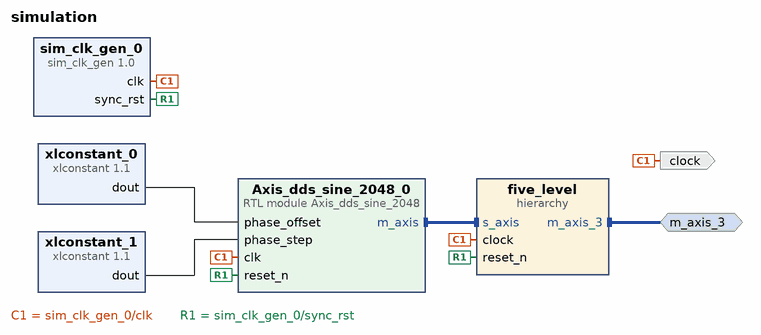
[diagram p0: block diagram of the top level]
# Vivado block design simulation, xc7z020clg400-1, Vivado 2025.2
create_bd_design simulation

create_bd_intf_port -mode Master -vlnv xilinx.com:interface:axis_rtl:1.0 m_axis_3
create_bd_port -dir O clock

create_bd_cell -type ip -vlnv xilinx.com:ip:sim_clk_gen:1.0 sim_clk_gen_0
create_bd_cell -type module -reference Axis_dds_sine_2048 Axis_dds_sine_2048_0
create_bd_cell -type ip -vlnv xilinx.com:ip:xlconstant:1.1 xlconstant_0
create_bd_cell -type ip -vlnv xilinx.com:ip:xlconstant:1.1 xlconstant_1
set_property -dict {CONFIG.CONST_VAL 33333333 CONFIG.CONST_WIDTH 32} [get_bd_cells xlconstant_1]
create_bd_cell -type hier five_level

# ---- hierarchy /five_level ----
current_bd_instance /five_level
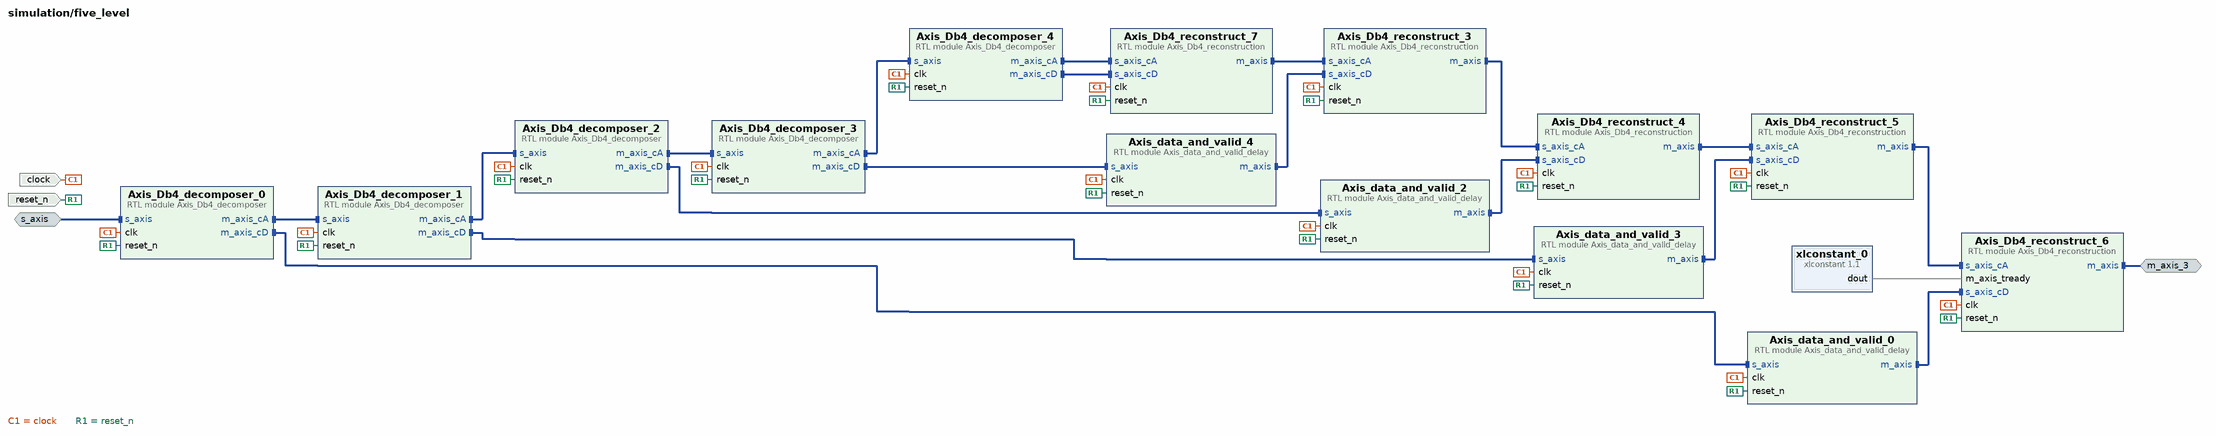
[diagram p1: block diagram inside /five_level]
create_bd_intf_pin -mode Slave -vlnv xilinx.com:interface:axis_rtl:1.0 s_axis
create_bd_intf_pin -mode Master -vlnv xilinx.com:interface:axis_rtl:1.0 m_axis_3
create_bd_pin -dir I -type clk clock
create_bd_pin -dir I -type rst reset_n

create_bd_cell -type module -reference Axis_Db4_decomposer Axis_Db4_decomposer_0
create_bd_cell -type module -reference Axis_data_and_valid_delay Axis_data_and_valid_0
set_property -dict {CONFIG.DATA_WIDTH 32 CONFIG.DELAY 292} [get_bd_cells Axis_data_and_valid_0]
create_bd_cell -type module -reference Axis_Db4_decomposer Axis_Db4_decomposer_1
create_bd_cell -type module -reference Axis_Db4_decomposer Axis_Db4_decomposer_2
create_bd_cell -type module -reference Axis_Db4_decomposer Axis_Db4_decomposer_3
create_bd_cell -type module -reference Axis_Db4_reconstruction Axis_Db4_reconstruct_3
set_property -dict {CONFIG.LEVEL 4} [get_bd_cells Axis_Db4_reconstruct_3]
create_bd_cell -type module -reference Axis_data_and_valid_delay Axis_data_and_valid_2
set_property -dict {CONFIG.DATA_WIDTH 32 CONFIG.DELAY 218} [get_bd_cells Axis_data_and_valid_2]
create_bd_cell -type module -reference Axis_Db4_reconstruction Axis_Db4_reconstruct_4
set_property -dict {CONFIG.LEVEL 3} [get_bd_cells Axis_Db4_reconstruct_4]
create_bd_cell -type module -reference Axis_data_and_valid_delay Axis_data_and_valid_3
set_property -dict {CONFIG.DATA_WIDTH 32 CONFIG.DELAY 263} [get_bd_cells Axis_data_and_valid_3]
create_bd_cell -type module -reference Axis_Db4_reconstruction Axis_Db4_reconstruct_5
set_property -dict {CONFIG.LEVEL 2} [get_bd_cells Axis_Db4_reconstruct_5]
create_bd_cell -type module -reference Axis_Db4_reconstruction Axis_Db4_reconstruct_6
set_property -dict {CONFIG.LEVEL 1} [get_bd_cells Axis_Db4_reconstruct_6]
create_bd_cell -type module -reference Axis_Db4_decomposer Axis_Db4_decomposer_4
create_bd_cell -type module -reference Axis_Db4_reconstruction Axis_Db4_reconstruct_7
set_property -dict {CONFIG.LEVEL 5} [get_bd_cells Axis_Db4_reconstruct_7]
create_bd_cell -type ip -vlnv xilinx.com:ip:xlconstant:1.1 xlconstant_0
create_bd_cell -type module -reference Axis_data_and_valid_delay Axis_data_and_valid_4
set_property -dict {CONFIG.DATA_WIDTH 32 CONFIG.DELAY 141} [get_bd_cells Axis_data_and_valid_4]

# ---- connections ----

current_bd_instance /five_level
connect_bd_intf_net [get_bd_intf_pins Axis_Db4_decomposer_0/m_axis_cA] [get_bd_intf_pins Axis_Db4_decomposer_1/s_axis]
connect_bd_intf_net [get_bd_intf_pins Axis_Db4_decomposer_0/m_axis_cD] [get_bd_intf_pins Axis_data_and_valid_0/s_axis]
connect_bd_intf_net [get_bd_intf_pins Axis_Db4_decomposer_1/m_axis_cA] [get_bd_intf_pins Axis_Db4_decomposer_2/s_axis]
connect_bd_intf_net [get_bd_intf_pins Axis_Db4_decomposer_1/m_axis_cD] [get_bd_intf_pins Axis_data_and_valid_3/s_axis]
connect_bd_intf_net [get_bd_intf_pins Axis_Db4_decomposer_2/m_axis_cA] [get_bd_intf_pins Axis_Db4_decomposer_3/s_axis]
connect_bd_intf_net [get_bd_intf_pins Axis_Db4_decomposer_2/m_axis_cD] [get_bd_intf_pins Axis_data_and_valid_2/s_axis]
connect_bd_intf_net [get_bd_intf_pins Axis_Db4_decomposer_3/m_axis_cA] [get_bd_intf_pins Axis_Db4_decomposer_4/s_axis]
connect_bd_intf_net [get_bd_intf_pins Axis_Db4_decomposer_3/m_axis_cD] [get_bd_intf_pins Axis_data_and_valid_4/s_axis]
connect_bd_intf_net [get_bd_intf_pins Axis_Db4_decomposer_4/m_axis_cA] [get_bd_intf_pins Axis_Db4_reconstruct_7/s_axis_cA]
connect_bd_intf_net [get_bd_intf_pins Axis_Db4_decomposer_4/m_axis_cD] [get_bd_intf_pins Axis_Db4_reconstruct_7/s_axis_cD]
connect_bd_intf_net [get_bd_intf_pins Axis_Db4_reconstruct_3/m_axis] [get_bd_intf_pins Axis_Db4_reconstruct_4/s_axis_cA]
connect_bd_intf_net [get_bd_intf_pins Axis_Db4_reconstruct_4/m_axis] [get_bd_intf_pins Axis_Db4_reconstruct_5/s_axis_cA]
connect_bd_intf_net [get_bd_intf_pins Axis_Db4_reconstruct_5/m_axis] [get_bd_intf_pins Axis_Db4_reconstruct_6/s_axis_cA]
connect_bd_intf_net [get_bd_intf_pins Axis_Db4_reconstruct_7/m_axis] [get_bd_intf_pins Axis_Db4_reconstruct_3/s_axis_cA]
connect_bd_intf_net -intf_net Axis_adder_0_m_axis [get_bd_intf_pins s_axis] [get_bd_intf_pins Axis_Db4_decomposer_0/s_axis]
connect_bd_intf_net [get_bd_intf_pins Axis_data_and_valid_0/m_axis] [get_bd_intf_pins Axis_Db4_reconstruct_6/s_axis_cD]
connect_bd_intf_net [get_bd_intf_pins Axis_data_and_valid_2/m_axis] [get_bd_intf_pins Axis_Db4_reconstruct_4/s_axis_cD]
connect_bd_intf_net [get_bd_intf_pins Axis_data_and_valid_3/m_axis] [get_bd_intf_pins Axis_Db4_reconstruct_5/s_axis_cD]
connect_bd_intf_net [get_bd_intf_pins Axis_data_and_valid_4/m_axis] [get_bd_intf_pins Axis_Db4_reconstruct_3/s_axis_cD]
connect_bd_intf_net [get_bd_intf_pins Axis_Db4_reconstruct_6/m_axis] [get_bd_intf_pins m_axis_3]
connect_bd_net -net sim_clk_gen_0_clk [get_bd_pins clock] \
  [get_bd_pins Axis_Db4_decomposer_0/clk] [get_bd_pins Axis_Db4_decomposer_1/clk] [get_bd_pins Axis_Db4_decomposer_2/clk] \
  [get_bd_pins Axis_data_and_valid_0/clk] [get_bd_pins Axis_Db4_decomposer_3/clk] [get_bd_pins Axis_Db4_reconstruct_3/clk] \
  [get_bd_pins Axis_data_and_valid_2/clk] [get_bd_pins Axis_Db4_reconstruct_4/clk] [get_bd_pins Axis_data_and_valid_3/clk] \
  [get_bd_pins Axis_Db4_reconstruct_5/clk] [get_bd_pins Axis_Db4_reconstruct_6/clk] [get_bd_pins Axis_Db4_decomposer_4/clk] \
  [get_bd_pins Axis_Db4_reconstruct_7/clk] [get_bd_pins Axis_data_and_valid_4/clk]
connect_bd_net -net sim_clk_gen_0_sync_rst [get_bd_pins reset_n] \
  [get_bd_pins Axis_Db4_decomposer_0/reset_n] [get_bd_pins Axis_Db4_decomposer_1/reset_n] \
  [get_bd_pins Axis_Db4_decomposer_2/reset_n] [get_bd_pins Axis_data_and_valid_0/reset_n] \
  [get_bd_pins Axis_Db4_decomposer_3/reset_n] [get_bd_pins Axis_Db4_reconstruct_3/reset_n] \
  [get_bd_pins Axis_data_and_valid_2/reset_n] [get_bd_pins Axis_Db4_reconstruct_4/reset_n] \
  [get_bd_pins Axis_data_and_valid_3/reset_n] [get_bd_pins Axis_Db4_reconstruct_5/reset_n] \
  [get_bd_pins Axis_Db4_reconstruct_6/reset_n] [get_bd_pins Axis_Db4_decomposer_4/reset_n] \
  [get_bd_pins Axis_Db4_reconstruct_7/reset_n] [get_bd_pins Axis_data_and_valid_4/reset_n]
connect_bd_net [get_bd_pins xlconstant_0/dout] [get_bd_pins Axis_Db4_reconstruct_6/m_axis_tready]

current_bd_instance /
connect_bd_intf_net [get_bd_intf_pins Axis_dds_sine_2048_0/m_axis] [get_bd_intf_pins five_level/s_axis]
connect_bd_intf_net -intf_net Three_level_m_axis_3 [get_bd_intf_ports m_axis_3] [get_bd_intf_pins five_level/m_axis_3]
connect_bd_net [get_bd_pins sim_clk_gen_0/clk] [get_bd_pins Axis_dds_sine_2048_0/clk] [get_bd_ports clock] [get_bd_pins five_level/clock]
connect_bd_net [get_bd_pins sim_clk_gen_0/sync_rst] [get_bd_pins Axis_dds_sine_2048_0/reset_n] [get_bd_pins five_level/reset_n]
connect_bd_net [get_bd_pins xlconstant_0/dout] [get_bd_pins Axis_dds_sine_2048_0/phase_offset]
connect_bd_net [get_bd_pins xlconstant_1/dout] [get_bd_pins Axis_dds_sine_2048_0/phase_step]

validate_bd_design
save_bd_design
